# EAGLE design schemat (EAGLE 9.5.2)
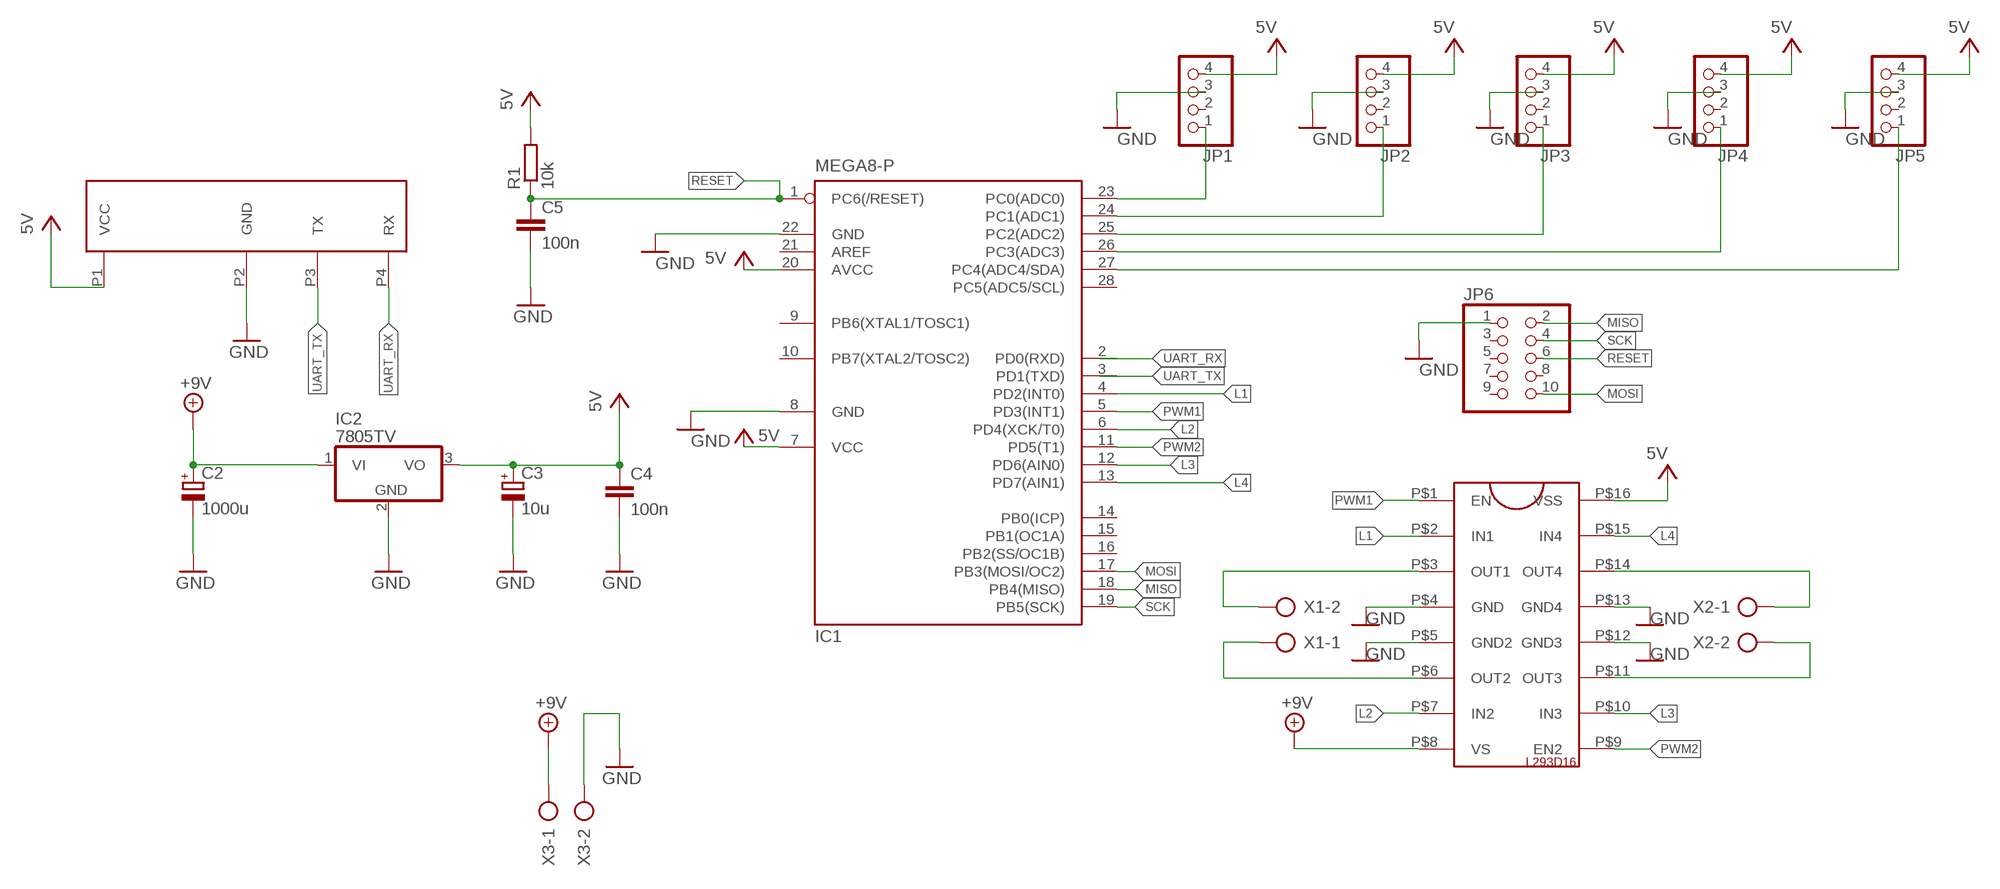
[diagram p0: schematic, sheet 1]

## Parts
C2  1000u  CPOL-EUE5-10.5  [E5-10,5]
C3  10u  CPOL-EUE5-10.5  [E5-10,5]
C4  100n  C-EU050-075X075  [C050-075X075]
C5  100n  C-EU050-075X075  [C050-075X075]
IC1  MEGA8-P  [DIL28-3]
IC2  7805TV  [TO220V]
JP1  PINHD-1X4/90  [1X04/90]
JP2  PINHD-1X4/90  [1X04/90]
JP3  PINHD-1X4/90  [1X04/90]
JP4  PINHD-1X4/90  [1X04/90]
JP5  PINHD-1X4/90  [1X04/90]
JP6  PINHD-2X5  [2X05]
R1  10k  R-EU_0309/10  [0309/10]
U$1  BTM222BTM222  [BTM222]
U$2  L293D16L293D16  [L293D]
X1  AK500/2  [AK500/2]
X2  AK500/2  [AK500/2]
X3  AK500/2  [AK500/2]

## Nets
+9V: C2.+ IC2.1(VI) U$2.P$8(VS) X3.1
GND: C2.- C3.- C4.2 C5.2 IC1.8(GND) IC1.22(GND) IC2.2(GND) JP1.3 JP2.3 JP3.3 JP4.3 JP5.3 JP6.1 U$1.P2(GND) U$2.P$4(GND) U$2.P$5(GND2) U$2.P$12(GND3) U$2.P$13(GND4) X3.2
L1: IC1.4(PD2(INT0)) U$2.P$2(IN1)
L2: IC1.6(PD4(XCK/T0)) U$2.P$7(IN2)
L3: IC1.12(PD6(AIN0)) U$2.P$10(IN3)
L4: IC1.13(PD7(AIN1)) U$2.P$15(IN4)
MISO: IC1.18(PB4(MISO)) JP6.2
MOSI: IC1.17(PB3(MOSI/OC2)) JP6.10
N$1: IC1.24(PC1(ADC1)) JP2.1
N$2: IC1.25(PC2(ADC2)) JP3.1
N$3: IC1.23(PC0(ADC0)) JP1.1
N$4: IC1.26(PC3(ADC3)) JP4.1
N$5: IC1.27(PC4(ADC4/SDA)) JP5.1
N$6: U$2.P$6(OUT2) X1.1
N$7: U$2.P$3(OUT1) X1.2
N$8: U$2.P$14(OUT4) X2.1
N$9: U$2.P$11(OUT3) X2.2
PWM1: IC1.5(PD3(INT1)) U$2.P$1(EN)
PWM2: IC1.11(PD5(T1)) U$2.P$9(EN2)
RESET: C5.1 IC1.1(PC6(/RESET)) JP6.6 R1.1
SCK: IC1.19(PB5(SCK)) JP6.4
UART_RX: IC1.2(PD0(RXD)) U$1.P4(RX)
UART_TX: IC1.3(PD1(TXD)) U$1.P3(TX)
VCC: C3.+ C4.1 IC1.7(VCC) IC1.20(AVCC) IC2.3(VO) JP1.4 JP2.4 JP3.4 JP4.4 JP5.4 R1.2 U$1.P1(VCC) U$2.P$16(VSS) ; supply symbol labelled 5V
Unconnected: IC1.9(PB6(XTAL1/TOSC1)) IC1.10(PB7(XTAL2/TOSC2)) IC1.14(PB0(ICP)) IC1.15(PB1(OC1A)) IC1.16(PB2(SS/OC1B)) IC1.21(AREF) IC1.28(PC5(ADC5/SCL)) JP1.2 JP2.2 JP3.2 JP4.2 JP5.2 JP6.3 JP6.5 JP6.7 JP6.8 JP6.9

## Library data of the parts
C2 C3 = rcl:CPOL-EU: POLARIZED CAPACITOR, European symbol; SPICEPREFIX: C
C4 C5 = rcl:C-EU: CAPACITOR, European symbol; SPICEPREFIX: C
IC1 = atmel:MEGA8-P: MICROCONTROLLER 8 Kbytes FLASH, 1 kbytes SRAM, 512 bytes EEPROM, USART, 4-channel 10 bit ADC, 2-channel 8 bit ADC Pin compatible with Atmega48, ATMega88, ATMega168 Source: avr.lbr; OC_FARNELL: unknown; OC_NEWARK: unknown
IC2 = linear:78*: Positive VOLTAGE REGULATOR Source: http://cache.national.com/ds/LM/LM78L05.pdf http://www.fairchildsemi.com/ds/LM/LM7805.pdf
JP1-JP5 = pinhead:PINHD-1X4: PIN HEADER
JP6 = pinhead:PINHD-2X5: PIN HEADER
R1 = rcl:R-EU_: RESISTOR, European symbol; SPICEPREFIX: R
U$1 = LIB1:BTM222
U$2 = my_library:L293D16
X1-X3 = con-ptr500:AK500/2: CONNECTOR; OC_FARNELL: unknown; OC_NEWARK: unknown

## Board
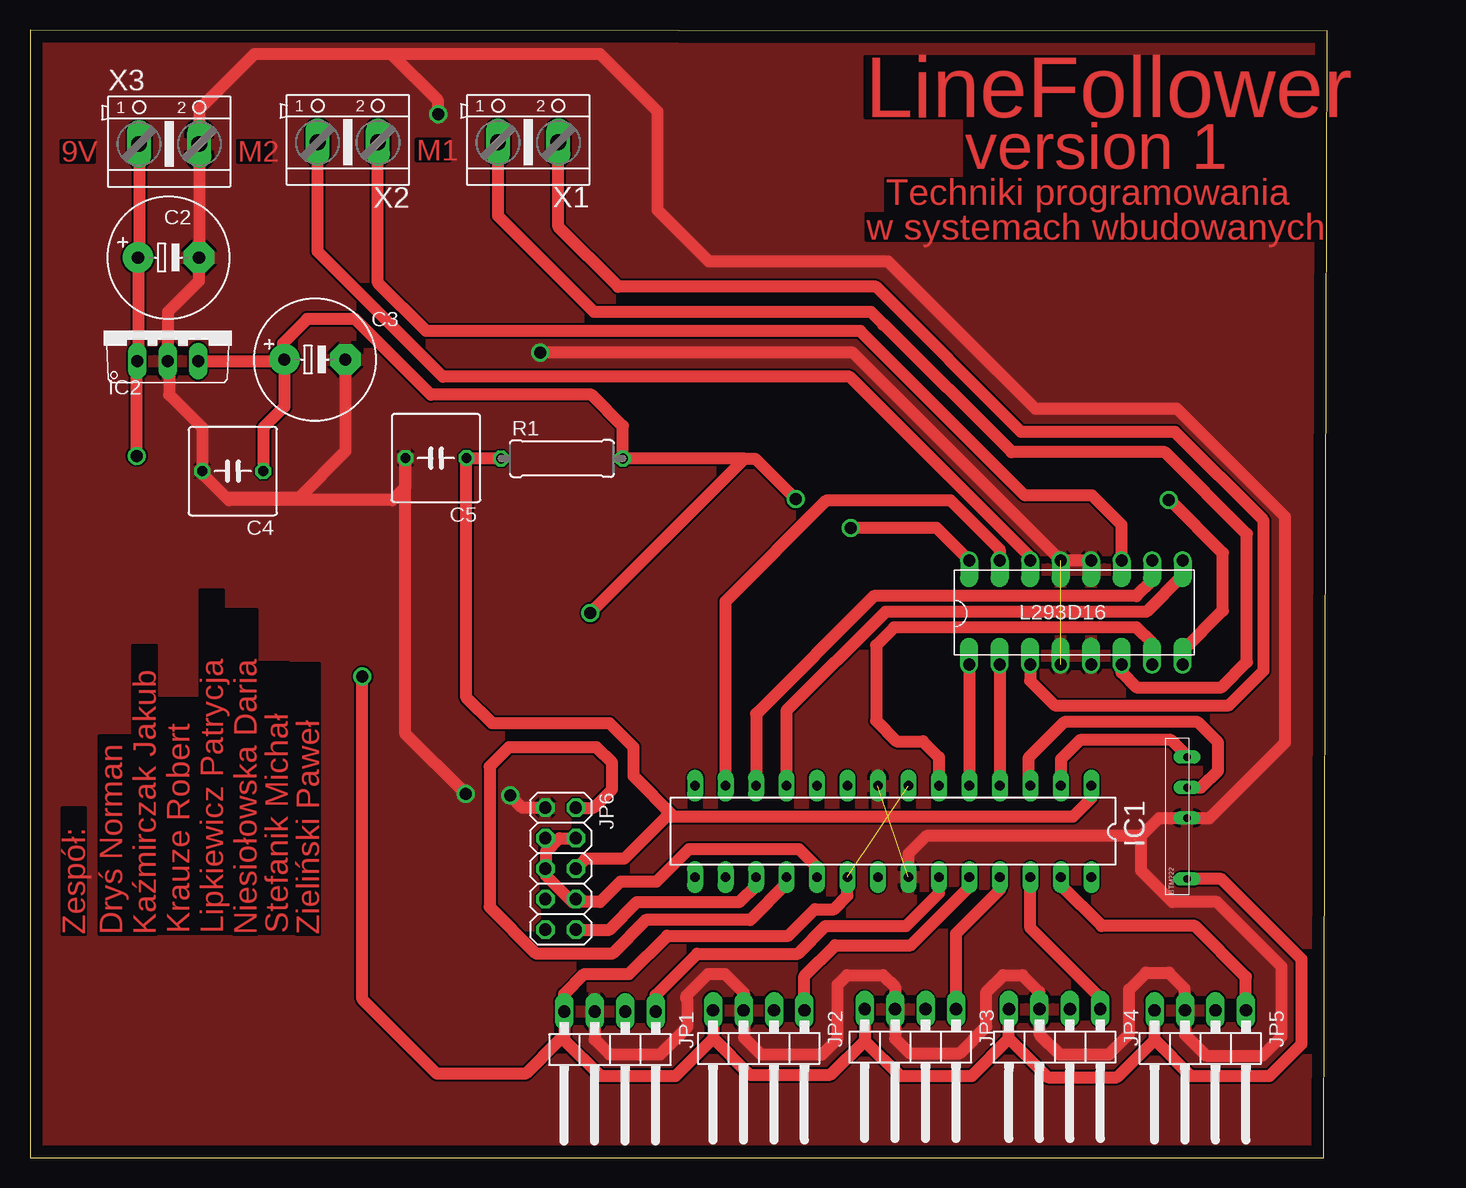
[diagram p1: board, top side]
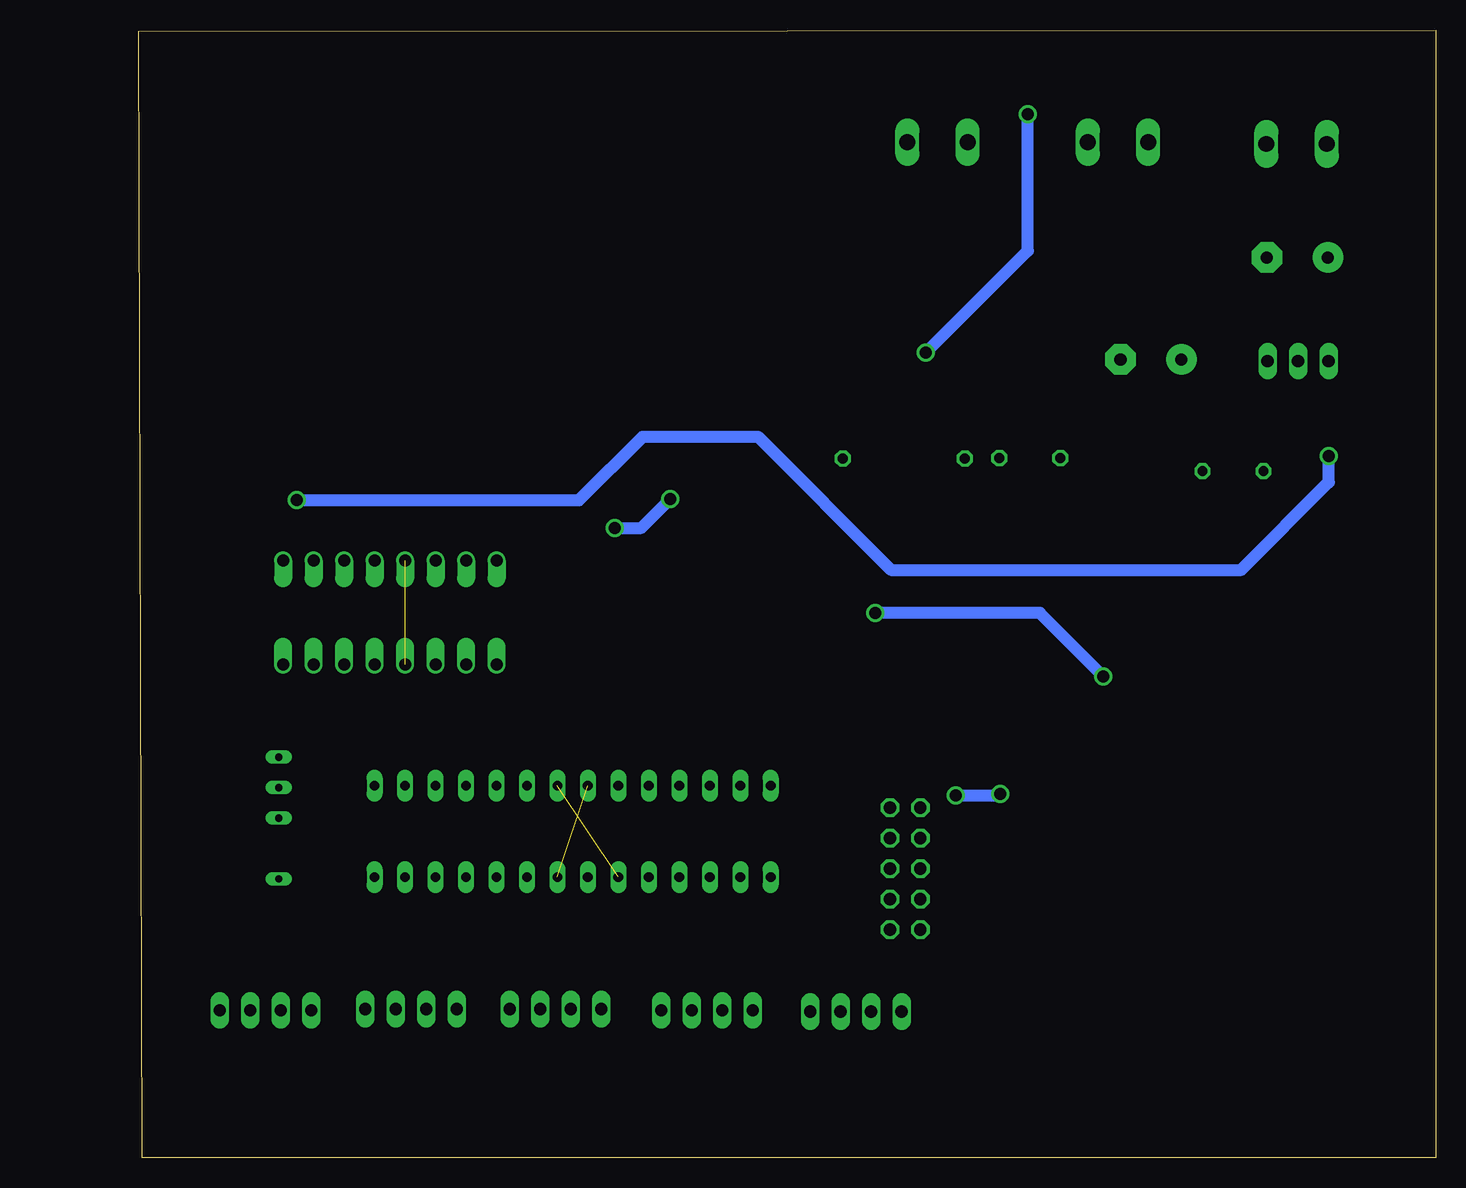
[diagram p2: board, bottom side, seen from below]

Size 108.1 x 94 mm. Coordinates in mm from the lower left corner, seen from the top.
Outline: 0,0 107.8,0 108.1,93.9 0,94 0,0
Copper layers (1*16): Top 0.035mm / dielectric 1.5mm / Bottom 0.035mm
Design rules "default": minimum track width 6mil, minimum drill 0.35mm, track to track 6mil, track to pad 6mil, pad to pad 6mil, via to via 6mil, smd to smd 6mil, copper to edge 40mil, drill to drill 6mil, minimum pad ring 10mil, minimum via ring 8mil, stop-mask expansion 4mil, vias tented up to drill 0mil, thermal gap 10mil

### Footprints (pad centres in the part's own frame; a part is rotated, then mirrored left to right if it is on the bottom)
E5-10,5 = drill 1.016 pad 2.54: + -2.54,0 | drill 1.016 pad 2.54 octagon: - 2.54,0
C050-075X075 = drill 0.813 octagon: 1 -2.54,0; 2 2.54,0
DIL28-3 = drill 0.813 long: 1 -16.51,-3.81; 2 -13.97,-3.81; 3 -11.43,-3.81; 4 -8.89,-3.81; 5 -6.35,-3.81; 6 -3.81,-3.81; 7 -1.27,-3.81; 8 1.27,-3.81; 9 3.81,-3.81; 10 6.35,-3.81; 11 8.89,-3.81; 12 11.43,-3.81; 13 13.97,-3.81; 14 16.51,-3.81; 15 16.51,3.81; 16 13.97,3.81; 17 11.43,3.81; 18 8.89,3.81; 19 6.35,3.81; 20 3.81,3.81; 21 1.27,3.81; 22 -1.27,3.81; 23 -3.81,3.81; 24 -6.35,3.81; 25 -8.89,3.81; 26 -11.43,3.81; 27 -13.97,3.81; 28 -16.51,3.81
TO220V = drill 1.016 long: 1 -2.54,-2.54; 2 0,-2.54; 3 2.54,-2.54
1X04/90 = drill 1.016 long: 1 -3.81,-3.81; 2 -1.27,-3.81; 3 1.27,-3.81; 4 3.81,-3.81
2X05 = drill 1.016 octagon: 1 -5.08,-1.27; 2 -5.08,1.27; 3 -2.54,-1.27; 4 -2.54,1.27; 5 0,-1.27; 6 0,1.27; 7 2.54,-1.27; 8 2.54,1.27; 9 5.08,-1.27; 10 5.08,1.27
0309/10 = drill 0.813 octagon: 1 -5.08,0; 2 5.08,0
BTM222 = drill 0.6 long: P1 1.27,0.2; P2 6.35,0.2; P3 8.89,0.2; P4 11.43,0.2
L293D = drill 1 offset: P$1 1.27,-0.8; P$2 3.81,-0.8; P$3 6.35,-0.8; P$4 8.89,-0.8; P$5 11.43,-0.8; P$6 13.97,-0.8; P$7 16.51,-0.8; P$8 19.05,-0.8; P$9 19.05,7.9; P$10 16.51,7.9; P$11 13.97,7.9; P$12 11.43,7.9; P$13 8.89,7.9; P$14 6.35,7.9; P$15 3.81,7.9; P$16 1.27,7.9
AK500/2 = drill 1.321 long: 1 -2.515,0; 2 2.515,0

### Placement (x,y rotation side)
C2  11.54,75.03 0 top
C3  23.74,66.53 0 top
C4  16.9,57.22 180 top
C5  33.83,58.31 180 top
IC1  71.93,27.19 180 top
IC2  11.48,68.94 0 top
JP1  48.33,8.36 180 top
JP2  60.73,8.46 180 top
JP3  73.36,8.56 180 top
JP4  85.39,8.56 180 top
JP5  97.52,8.46 180 top
JP6  44.22,24.08 270 top
R1  44.33,58.27 0 top
U$1  96.62,21.95 90 top
U$2  77,41.89 0 top
X1  41.52,84.64 0 top
X2  26.48,84.64 0 top
X3  11.6,84.5 0 top

### Tracks (layer width: path | path; a pad name or v marks a point on that pad's centre or on a via)
+9V  (via drill 1)
  Top 1.016: X3.1 9.09,75.11 C2.+ 9,66.46 IC2.1 8.9,66.36 v8.9,58.5 | U$2.P$8 96.05,42.25 99.4,45.6 99.4,50.4 95,54.8 v94.9,54.8
  Bottom 1.016: v94.9,54.8 71.4,54.8 66.1,60.1 56.5,60.1 45.4,49 16.2,49 8.9,56.3 v8.9,58.5
GND  (via drill 1)  (2 unrouted)
  Top 1.016: JP1.3 47.06,9.84 48.3,8.6 52.5,8.6 54.8,10.9 54.8,13.1 54.7,13.2 54.7,13.5 56.5,15.3 57.9,15.3 59.5,13.7 59.5,10 60.9,8.6 66,8.6 67.3,9.9 67.3,14.4 68.1,15.2 71.1,15.2 72.09,14.21 JP3.3 72.09,9.91 73.3,8.7 77.5,8.7 79.7,10.9 79.7,13.8 81.1,15.2 82.7,15.2 84.12,13.78 JP4.3 84.12,10.28 85.8,8.6 89.9,8.6 91.6,10.3 91.6,14 93,15.4 94.9,15.4 96.2,14.1 96.2,11.8 | JP5.3 96.25,10.25 98,8.5 102.7,8.5 104.3,10.1 104.3,15.9 98.9,21.3 95.2,21.3 92.6,23.9 92.6,26.8 | 92.6,26.8 94.1,28.3 U$1.P2 98.3,28.3 104.6,34.6 104.6,53.4 95.6,62.4 83.8,62.4 71.5,74.7 56.6,74.7 52.3,79 52.3,87.2 47.5,92 30.1,92 | C3.- 26.28,58.88 22.4,55 16.4,55 | 16.4,55 14.36,57.04 C4.2 14.36,60.84 11.6,63.6 11.6,66.28 IC2.2 11.48,70.48 14.08,73.08 C2.- 14.12,75.06 X3.2 14.12,87.41 18.7,92 30.1,92 | 16.4,55 16.6,54.8 30.2,54.8 31.29,55.89 C5.2 31.29,35.31 v36.3,30.3 | 42.89,29.1 JP6.1 41.04,29.16 v40,30.2 | 92.6,26.8 74.7,26.8 73.2,25.3 IC1.22 | U$2.P$12 U$2.P$13 68.6,67.08 68.6,67.1 v42.5,67.1 | v34,87 34,88.1 30.1,92
  Bottom 1.016: v40,30.2 36.4,30.2 v36.3,30.3 | v34,87 34,75.6 v42.5,67.1
  pour Top: 0.1,94.1 0.1,0.2 107.7,0.2 107.7,0.5 107.7,94.1 0.6,94.1 0.6,94.2 0.1,94.2
L1
  Top 1.016: U$2.P$2 IC1.4
L2
  Top 1.016: 93.4,42.8 93.51,42.69 U$2.P$7 93.51,42.89 92.2,44.2 72,44.2 70.5,42.7 70.5,36.4 72.2,34.7 74.4,34.7 75.74,33.36 IC1.6
L3
  Top 1.016: U$2.P$10 93.51,48.11 92.2,46.8 70.3,46.8 60.5,37 IC1.12
L4
  Top 1.016: IC1.13 57.96,46.36 66.4,54.8 76.7,54.8 80.81,50.69 U$2.P$15
MISO
  Top 1.016: JP6.2 46.96,29.16 48.5,30.7 48.5,32.9 47.2,34.2 39.9,34.2 38.3,32.6 38.3,20.9 42.2,17 48.5,17 51.3,19.8 60,19.8 63.04,22.84 IC1.18
MOSI
  Top 1.016: 60.5,22.6 IC1.17 60.5,22.7 59.1,21.3 50.6,21.3 48.3,19 JP6.10
N$1
  Top 1.016: JP2.1 64.54,15.14 67.1,17.7 73.4,17.7 78.28,22.58 IC1.24
N$2
  Top 1.016: JP3.1 77.17,18.67 80.82,22.32 IC1.25
N$3
  Top 1.016: IC1.23 75.74,22.04 73,19.3 66.3,19.3 64,17 55.6,17 52.14,13.54 JP1.1
N$4
  Top 1.016: JP4.1 89.2,13.3 83.36,19.14 IC1.26
N$5
  Top 1.016: JP5.1 101.33,15.07 97.1,19.3 89.3,19.3 85.9,22.7 IC1.27
N$6
  Top 1.016: U$2.P$6 90.97,40.43 92.2,39.2 99.3,39.2 101.4,41.3 101.4,52 94.6,58.8 81.8,58.8 71.2,69.4 | 71.1,69.4 71.2,69.4 | 71.2,69.4 70.1,70.5 47,70.5 39,78.5 X1.1
N$7
  Top 1.016: U$2.P$3 83.35,39.75 85.4,37.7 99.9,37.7 102.8,40.6 102.8,53.1 95.4,60.5 82.6,60.5 70.5,72.6 49,72.6 44.03,77.56 X1.2
N$8
  Top 1.016: U$2.P$14 83.35,50.05 68.3,65.1 34.4,65.1 23.96,75.53 X2.1
N$9
  Top 1.016: U$2.P$11 90.97,52.73 88.5,55.2 82.9,55.2 69.2,68.9 33,68.9 28.99,72.91 X2.2
PWM1
  Top 1.016: U$2.P$1 IC1.5
PWM2
  Top 1.016: U$2.P$9 96.05,48.55 93,45.5 71.3,45.5 63.04,37.24 IC1.11
RESET
  Top 1.016: IC1.1 88.44,29.94 86.9,28.4 53.7,28.4 | JP6.6 46.31,24.9 49.5,24.9 53,28.4 53.7,28.4 | R1.1 39.21,58.31 C5.1 36.37,38.33 38.5,36.2 48.3,36.2 50.3,34.2 50.3,31.8 53.7,28.4
SCK
  Top 1.016: IC1.19 65.58,24.18 65.6,24.2 64.1,25.7 54.9,25.7 52.2,23 49.2,23 47.5,21.3 45.2,21.3 43,23.5 43,25.5 44.12,26.62 JP6.4
UART_RX
  Top 1.016: U$1.P4 96.42,33.48 95.1,34.8 87.5,34.8 85.9,33.2 IC1.2
UART_TX
  Top 1.016: U$1.P3 97.6,30.84 99,32.24 99,34.6 97.3,36.3 86.2,36.3 83.2,33.3 83.2,31.16 IC1.3
VCC  (via drill 1)  (1 unrouted)
  Top 1.016: 44.52,9.78 JP1.4 44.52,13.62 46.2,15.3 49.9,15.3 53.1,18.5 63.2,18.5 65.4,20.7 67,20.7 68.12,21.82 IC1.20 | 56.92,9.92 53.8,6.8 47.5,6.8 44.52,9.78 | JP2.4 56.92,9.92 | 56.92,9.92 59.94,6.9 66.7,6.9 69.55,9.75 | JP3.4 69.55,9.75 | 69.55,9.75 72.5,6.8 78.5,6.8 81.58,9.88 | 81.58,9.88 JP4.4 | 81.58,9.88 81.62,9.88 84.8,6.7 90.6,6.7 93.71,9.81 | 93.71,9.81 JP5.4 | 93.71,9.81 96.7,6.82 96.7,6.8 103.3,6.8 105.98,9.48 105.98,16.52 99.28,23.22 U$1.P1 | IC2.3 21.07,66.4 | 21.07,66.4 C3.+ 21.2,62.6 19.44,60.84 C4.1 | 21.07,66.4 21.07,67.87 23.1,69.9 27.1,69.9 33.4,63.6 46.8,63.6 49.41,60.99 R1.2 59.57,58.27 | U$2.P$16 75.56,52.5 v68.4,52.5 | v63.8,54.9 60.43,58.27 59.57,58.27 | 44.52,9.78 44.08,9.78 41.3,7 33.9,7 27.7,13.2 v27.7,40.1 | v46.7,45.4 59.57,58.27
  Bottom 1.016: v68.4,52.5 66.2,52.5 v63.8,54.9 | v27.7,40.1 33,45.4 v46.7,45.4

### Text on the board
Top: LineFollower | 9V | M2 | M1 | version 1 | Techniki programowania | w systemach wbudowanych | Zespół: | Dryś Norman | Kaźmirczak Jakub | Krauze Robert | Lipkiewicz Patrycja | Niesiołowska Daria | Stefanik Michał | Zieliński Paweł